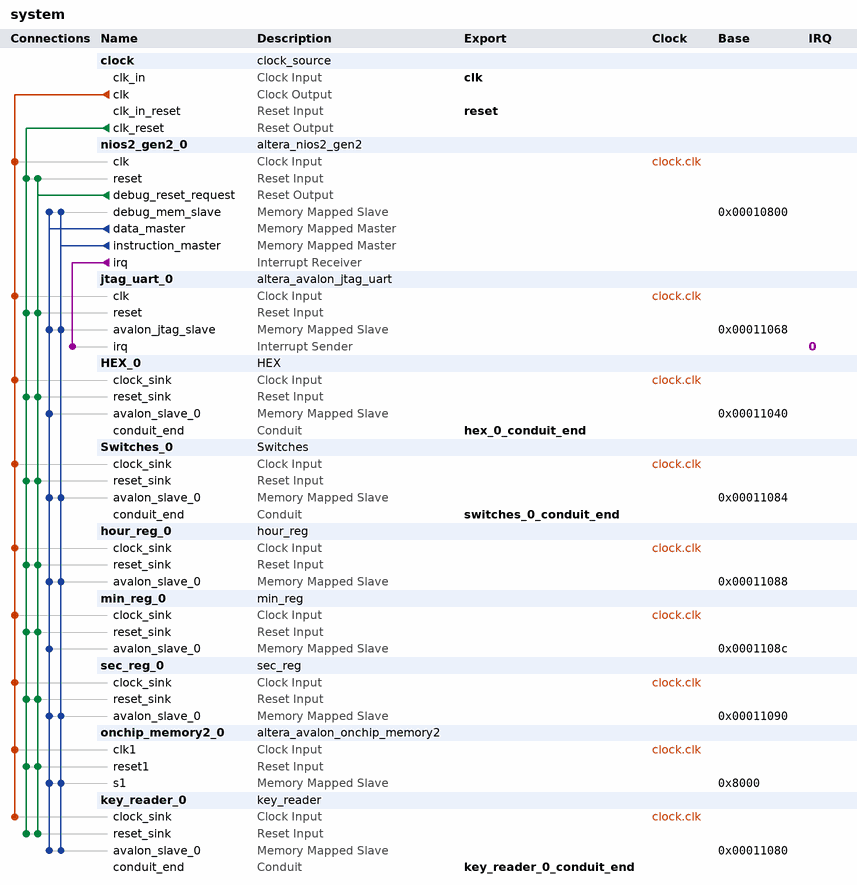
[diagram p0: system contents]
# Platform Designer (Qsys) system system, Cyclone V 5CSXFC6D6F31C6
# Parameters at their usual value, and those the tool derives, are not listed.
package require -exact qsys 18.1
create_system system
set_project_property DEVICE_FAMILY {Cyclone V}
set_project_property DEVICE 5CSXFC6D6F31C6

add_instance clock clock_source 18.1
set_instance_parameter_value clock clockFrequency 50000000

add_instance nios2_gen2_0 altera_nios2_gen2 18.1
set_instance_parameter_value nios2_gen2_0 dcache_size 2048
set_instance_parameter_value nios2_gen2_0 exceptionSlave onchip_memory2_0.s1
set_instance_parameter_value nios2_gen2_0 icache_size 4096
set_instance_parameter_value nios2_gen2_0 impl Tiny
set_instance_parameter_value nios2_gen2_0 resetSlave onchip_memory2_0.s1

add_instance jtag_uart_0 altera_avalon_jtag_uart 18.1
set_instance_parameter_value jtag_uart_0 simInteractiveOptions NO_INTERACTIVE_WINDOWS

add_instance HEX_0 HEX 1.0

add_instance Switches_0 Switches 1.0

add_instance hour_reg_0 hour_reg 1.0

add_instance min_reg_0 min_reg 1.0

add_instance sec_reg_0 sec_reg 1.0

add_instance onchip_memory2_0 altera_avalon_onchip_memory2 18.1
set_instance_parameter_value onchip_memory2_0 dataWidth 32
set_instance_parameter_value onchip_memory2_0 dualPort false
set_instance_parameter_value onchip_memory2_0 initMemContent true
set_instance_parameter_value onchip_memory2_0 initializationFileName onchip_mem.hex
set_instance_parameter_value onchip_memory2_0 memorySize 32768

add_instance key_reader_0 key_reader 1.0

# connections
add_connection clock.clk HEX_0.clock_sink clock
add_connection clock.clk hour_reg_0.clock_sink clock
add_connection clock.clk jtag_uart_0.clk clock
add_connection clock.clk key_reader_0.clock_sink clock
add_connection clock.clk min_reg_0.clock_sink clock
add_connection clock.clk nios2_gen2_0.clk clock
add_connection clock.clk onchip_memory2_0.clk1 clock
add_connection clock.clk sec_reg_0.clock_sink clock
add_connection clock.clk Switches_0.clock_sink clock
add_connection clock.clk_reset HEX_0.reset_sink reset
add_connection clock.clk_reset hour_reg_0.reset_sink reset
add_connection clock.clk_reset jtag_uart_0.reset reset
add_connection clock.clk_reset key_reader_0.reset_sink reset
add_connection clock.clk_reset min_reg_0.reset_sink reset
add_connection clock.clk_reset nios2_gen2_0.reset reset
add_connection clock.clk_reset onchip_memory2_0.reset1 reset
add_connection clock.clk_reset sec_reg_0.reset_sink reset
add_connection clock.clk_reset Switches_0.reset_sink reset
add_connection nios2_gen2_0.debug_reset_request HEX_0.reset_sink reset
add_connection nios2_gen2_0.debug_reset_request hour_reg_0.reset_sink reset
add_connection nios2_gen2_0.debug_reset_request jtag_uart_0.reset reset
add_connection nios2_gen2_0.debug_reset_request key_reader_0.reset_sink reset
add_connection nios2_gen2_0.debug_reset_request min_reg_0.reset_sink reset
add_connection nios2_gen2_0.debug_reset_request nios2_gen2_0.reset reset
add_connection nios2_gen2_0.debug_reset_request onchip_memory2_0.reset1 reset
add_connection nios2_gen2_0.debug_reset_request sec_reg_0.reset_sink reset
add_connection nios2_gen2_0.debug_reset_request Switches_0.reset_sink reset
add_connection nios2_gen2_0.data_master HEX_0.avalon_slave_0 avalon
set_connection_parameter_value nios2_gen2_0.data_master/HEX_0.avalon_slave_0 baseAddress 0x00011040
add_connection nios2_gen2_0.data_master hour_reg_0.avalon_slave_0 avalon
set_connection_parameter_value nios2_gen2_0.data_master/hour_reg_0.avalon_slave_0 baseAddress 0x00011088
add_connection nios2_gen2_0.data_master jtag_uart_0.avalon_jtag_slave avalon
set_connection_parameter_value nios2_gen2_0.data_master/jtag_uart_0.avalon_jtag_slave baseAddress 0x00011068
add_connection nios2_gen2_0.data_master key_reader_0.avalon_slave_0 avalon
set_connection_parameter_value nios2_gen2_0.data_master/key_reader_0.avalon_slave_0 baseAddress 0x00011080
add_connection nios2_gen2_0.data_master min_reg_0.avalon_slave_0 avalon
set_connection_parameter_value nios2_gen2_0.data_master/min_reg_0.avalon_slave_0 baseAddress 0x0001108c
add_connection nios2_gen2_0.data_master nios2_gen2_0.debug_mem_slave avalon
set_connection_parameter_value nios2_gen2_0.data_master/nios2_gen2_0.debug_mem_slave baseAddress 0x00010800
add_connection nios2_gen2_0.data_master onchip_memory2_0.s1 avalon
set_connection_parameter_value nios2_gen2_0.data_master/onchip_memory2_0.s1 baseAddress 0x8000
add_connection nios2_gen2_0.data_master sec_reg_0.avalon_slave_0 avalon
set_connection_parameter_value nios2_gen2_0.data_master/sec_reg_0.avalon_slave_0 baseAddress 0x00011090
add_connection nios2_gen2_0.data_master Switches_0.avalon_slave_0 avalon
set_connection_parameter_value nios2_gen2_0.data_master/Switches_0.avalon_slave_0 baseAddress 0x00011084
add_connection nios2_gen2_0.instruction_master hour_reg_0.avalon_slave_0 avalon
set_connection_parameter_value nios2_gen2_0.instruction_master/hour_reg_0.avalon_slave_0 baseAddress 0x00011088
add_connection nios2_gen2_0.instruction_master jtag_uart_0.avalon_jtag_slave avalon
set_connection_parameter_value nios2_gen2_0.instruction_master/jtag_uart_0.avalon_jtag_slave baseAddress 0x00011068
add_connection nios2_gen2_0.instruction_master key_reader_0.avalon_slave_0 avalon
set_connection_parameter_value nios2_gen2_0.instruction_master/key_reader_0.avalon_slave_0 baseAddress 0x00011080
add_connection nios2_gen2_0.instruction_master nios2_gen2_0.debug_mem_slave avalon
set_connection_parameter_value nios2_gen2_0.instruction_master/nios2_gen2_0.debug_mem_slave baseAddress 0x00010800
add_connection nios2_gen2_0.instruction_master onchip_memory2_0.s1 avalon
set_connection_parameter_value nios2_gen2_0.instruction_master/onchip_memory2_0.s1 baseAddress 0x8000
add_connection nios2_gen2_0.instruction_master sec_reg_0.avalon_slave_0 avalon
set_connection_parameter_value nios2_gen2_0.instruction_master/sec_reg_0.avalon_slave_0 baseAddress 0x00011090
add_connection nios2_gen2_0.instruction_master Switches_0.avalon_slave_0 avalon
set_connection_parameter_value nios2_gen2_0.instruction_master/Switches_0.avalon_slave_0 baseAddress 0x00011084
add_connection nios2_gen2_0.irq jtag_uart_0.irq interrupt
set_connection_parameter_value nios2_gen2_0.irq/jtag_uart_0.irq irqNumber 0

# exported interfaces
add_interface clk clock sink
set_interface_property clk EXPORT_OF clock.clk_in
add_interface hex_0_conduit_end conduit end
set_interface_property hex_0_conduit_end EXPORT_OF HEX_0.conduit_end
add_interface key_reader_0_conduit_end conduit end
set_interface_property key_reader_0_conduit_end EXPORT_OF key_reader_0.conduit_end
add_interface reset reset sink
set_interface_property reset EXPORT_OF clock.clk_in_reset
add_interface switches_0_conduit_end conduit end
set_interface_property switches_0_conduit_end EXPORT_OF Switches_0.conduit_end

set_interconnect_requirement {$system} qsys_mm.clockCrossingAdapter HANDSHAKE
set_interconnect_requirement {$system} qsys_mm.enableEccProtection FALSE
set_interconnect_requirement {$system} qsys_mm.insertDefaultSlave FALSE
set_interconnect_requirement {$system} qsys_mm.maxAdditionalLatency 1

save_system system.qsys
